# Altium schematic sheet FPGA_PWR.SchDoc
size A4; SheetNumber: 6; SheetTotal: 9
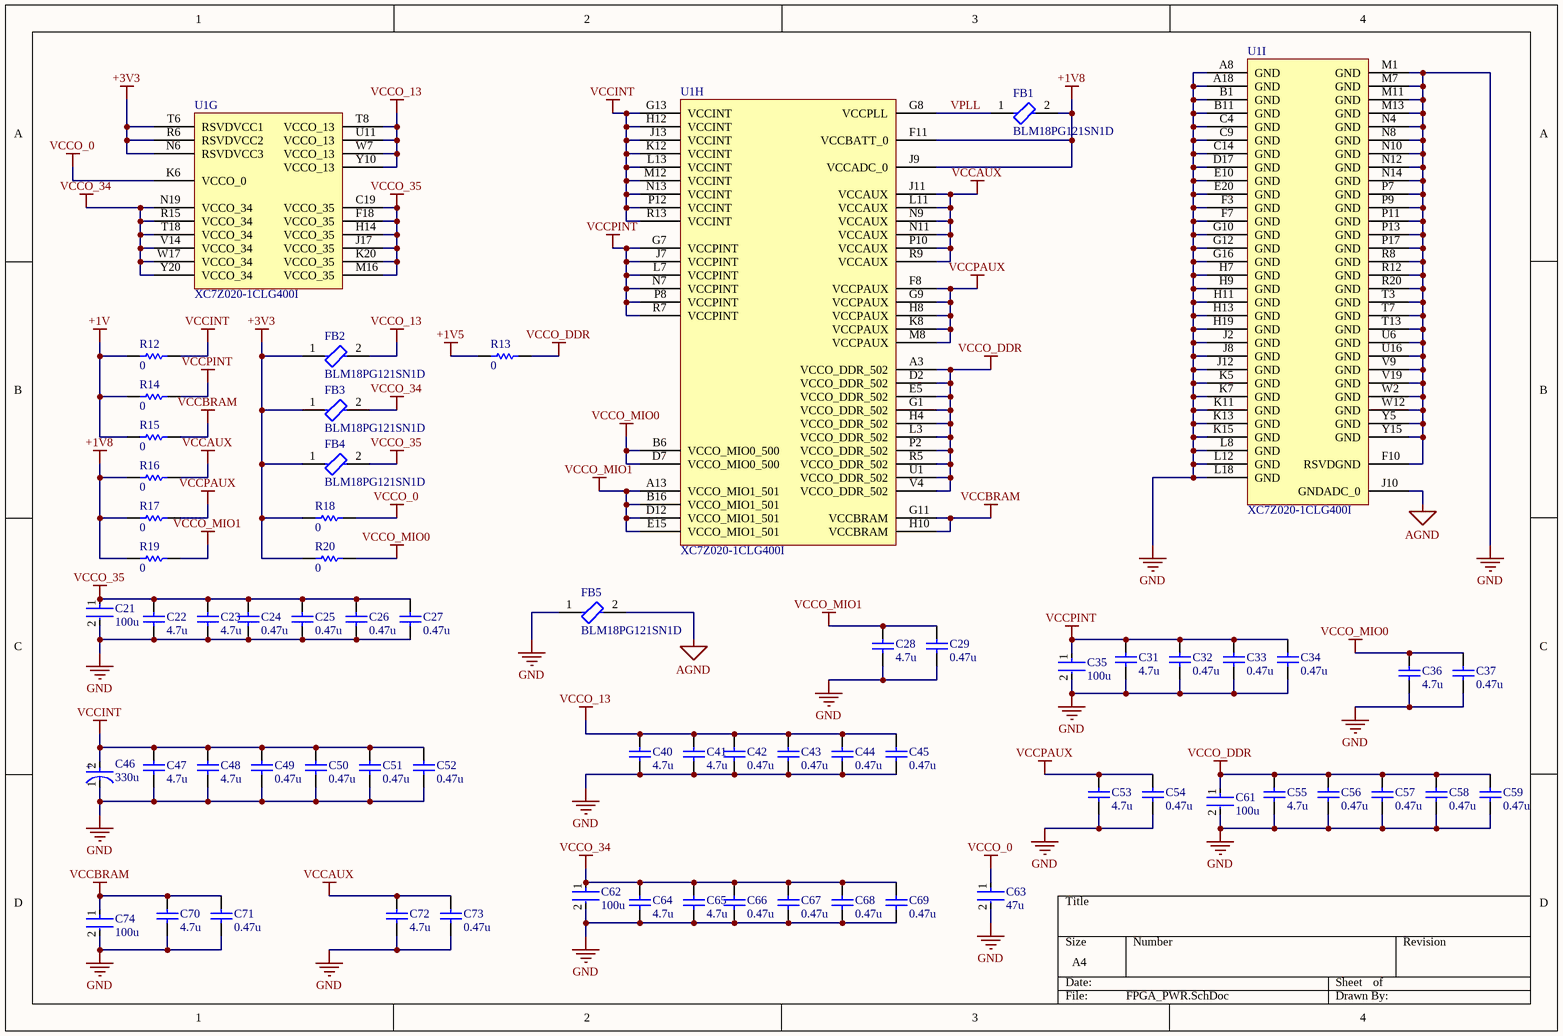
[diagram p0: FPGA_PWR.SchDoc]

## Parts
C21  100u  [FP-GRM32E-0_3-0_2-MFG]
C22  4.7u  [CAPC2013X135X45LL10T25]
C23  4.7u  [CAPC2013X135X45LL10T25]
C24  0.47u  [CAPC1608X90X35LL10T15]
C25  0.47u  [CAPC1608X90X35LL10T15]
C26  0.47u  [CAPC1608X90X35LL10T15]
C27  0.47u  [CAPC1608X90X35LL10T15]
C28  4.7u  [CAPC2013X135X45LL10T25]
C29  0.47u  [CAPC1608X90X35LL10T15]
C31  4.7u  [CAPC2013X135X45LL10T25]
C32  0.47u  [CAPC1608X90X35LL10T15]
C33  0.47u  [CAPC1608X90X35LL10T15]
C34  0.47u  [CAPC1608X90X35LL10T15]
C35  100u  [FP-GRM32E-0_3-0_2-MFG]
C36  4.7u  [CAPC2013X135X45LL10T25]
C37  0.47u  [CAPC1608X90X35LL10T15]
C40  4.7u  [CAPC2013X135X45LL10T25]
C41  4.7u  [CAPC2013X135X45LL10T25]
C42  0.47u  [CAPC1608X90X35LL10T15]
C43  0.47u  [CAPC1608X90X35LL10T15]
C44  0.47u  [CAPC1608X90X35LL10T15]
C45  0.47u  [CAPC1608X90X35LL10T15]
C46  330u  [FP-POSCAP-D2E-MFG]
C47  4.7u  [CAPC2013X135X45LL10T25]
C48  4.7u  [CAPC2013X135X45LL10T25]
C49  0.47u  [CAPC1608X90X35LL10T15]
C50  0.47u  [CAPC1608X90X35LL10T15]
C51  0.47u  [CAPC1608X90X35LL10T15]
C52  0.47u  [CAPC1608X90X35LL10T15]
C53  4.7u  [CAPC2013X135X45LL10T25]
C54  0.47u  [CAPC1608X90X35LL10T15]
C55  4.7u  [CAPC2013X135X45LL10T25]
C56  0.47u  [CAPC1608X90X35LL10T15]
C57  0.47u  [CAPC1608X90X35LL10T15]
C58  0.47u  [CAPC1608X90X35LL10T15]
C59  0.47u  [CAPC1608X90X35LL10T15]
C61  100u  [FP-GRM32E-0_3-0_2-MFG]
C62  100u  [FP-GRM32E-0_3-0_2-MFG]
C63  47u  [FP-GRM32E-0_3-0_2-IPC_C]
C64  4.7u  [CAPC2013X135X45LL10T25]
C65  4.7u  [CAPC2013X135X45LL10T25]
C66  0.47u  [CAPC1608X90X35LL10T15]
C67  0.47u  [CAPC1608X90X35LL10T15]
C68  0.47u  [CAPC1608X90X35LL10T15]
C69  0.47u  [CAPC1608X90X35LL10T15]
C70  4.7u  [CAPC2013X135X45LL10T25]
C71  0.47u  [CAPC1608X90X35LL10T15]
C72  4.7u  [CAPC2013X135X45LL10T25]
C73  0.47u  [CAPC1608X90X35LL10T15]
C74  100u  [FP-GRM32E-0_3-0_2-MFG]
FB1  BLM18PG121SN1D  [FP-BLM18-0_15-t0_8-IPC_A]
FB2  BLM18PG121SN1D  [FP-BLM18-0_15-t0_8-IPC_A]
FB3  BLM18PG121SN1D  [FP-BLM18-0_15-t0_8-IPC_A]
FB4  BLM18PG121SN1D  [FP-BLM18-0_15-t0_8-IPC_A]
FB5  BLM18PG121SN1D  [FP-BLM18-0_15-t0_8-IPC_A]
R12  0  [RESC1608X55X25ML10T15]
R13  0  [RESC1608X55X25ML10T15]
R14  0  [RESC1608X55X25ML10T15]
R15  0  [RESC1608X55X25ML10T15]
R16  0  [RESC1608X55X25ML10T15]
R17  0  [RESC1608X55X25ML10T15]
R18  0  [RESC1608X55X25ML10T15]
R19  0  [RESC1608X55X25ML10T15]
R20  0  [RESC1608X55X25ML10T15]
U1  XC7Z020-1CLG400I  [CLG400]  (parts G,H,I of 9)

## Nets
+1V: R12.2 R14.2 R15.2
+1V5: R13.2
+1V8: FB1.2 R16.2 R17.2 R19.2 U1.F11(VCCBATT_0) U1.J9(VCCADC_0)
+3V3: FB2.1 FB3.1 FB4.1 R18.2 R20.2 U1.N6(RSVDVCC3) U1.R6(RSVDVCC2) U1.T6(RSVDVCC1)
AGND: FB5.2 U1.J10(GNDADC_0)
GND: C21.2 C22.1 C23.1 C24.1 C25.1 C26.1 C27.1 C28.1 C29.1 C31.1 C32.1 C33.1 C34.1 C35.2 C36.1 C37.1 C40.1 C41.1 C42.1 C43.1 C44.1 C45.1 C46.1(C) C47.1 C48.1 C49.1 C50.1 C51.1 C52.1 C53.1 C54.1 C55.1 C56.1 C57.1 C58.1 C59.1 C61.2 C62.2 C63.2 C64.1 C65.1 C66.1 C67.1 C68.1 C69.1 C70.1 C71.1 C72.1 C73.1 C74.2 FB5.1 U1.A8(GND) U1.A18(GND) U1.B1(GND) U1.B11(GND) U1.C4(GND) U1.C9(GND) U1.C14(GND) U1.D17(GND) U1.E10(GND) U1.E20(GND) U1.F3(GND) U1.F7(GND) U1.F10(RSVDGND) U1.G10(GND) U1.G12(GND) U1.G16(GND) U1.H7(GND) U1.H9(GND) U1.H11(GND) U1.H13(GND) U1.H19(GND) U1.J2(GND) U1.J8(GND) U1.J12(GND) U1.K5(GND) U1.K7(GND) U1.K11(GND) U1.K13(GND) U1.K15(GND) U1.L8(GND) U1.L12(GND) U1.L18(GND) U1.M1(GND) U1.M7(GND) U1.M11(GND) U1.M13(GND) U1.N4(GND) U1.N8(GND) U1.N10(GND) U1.N12(GND) U1.N14(GND) U1.P7(GND) U1.P9(GND) U1.P11(GND) U1.P13(GND) U1.P17(GND) U1.R8(GND) U1.R12(GND) U1.R20(GND) U1.T3(GND) U1.T7(GND) U1.T13(GND) U1.U6(GND) U1.U16(GND) U1.V9(GND) U1.V19(GND) U1.W2(GND) U1.W12(GND) U1.Y5(GND) U1.Y15(GND)
VCCAUX: C72.2 C73.2 R16.1 U1.J11(VCCAUX) U1.L11(VCCAUX) U1.N9(VCCAUX) U1.N11(VCCAUX) U1.P10(VCCAUX) U1.R9(VCCAUX)
VCCBRAM: C70.2 C71.2 C74.1 R15.1 U1.G11(VCCBRAM) U1.H10(VCCBRAM)
VCCINT: C46.2(A) C47.2 C48.2 C49.2 C50.2 C51.2 C52.2 R12.1 U1.G13(VCCINT) U1.H12(VCCINT) U1.J13(VCCINT) U1.K12(VCCINT) U1.L13(VCCINT) U1.M12(VCCINT) U1.N13(VCCINT) U1.P12(VCCINT) U1.R13(VCCINT)
VCCO_0: C63.1 R18.1 U1.K6(VCCO_0)
VCCO_13: C40.2 C41.2 C42.2 C43.2 C44.2 C45.2 FB2.2 U1.T8(VCCO_13) U1.U11(VCCO_13) U1.W7(VCCO_13) U1.Y10(VCCO_13)
VCCO_34: C62.1 C64.2 C65.2 C66.2 C67.2 C68.2 C69.2 FB3.2 U1.N19(VCCO_34) U1.R15(VCCO_34) U1.T18(VCCO_34) U1.V14(VCCO_34) U1.W17(VCCO_34) U1.Y20(VCCO_34)
VCCO_35: C21.1 C22.2 C23.2 C24.2 C25.2 C26.2 C27.2 FB4.2 U1.C19(VCCO_35) U1.F18(VCCO_35) U1.H14(VCCO_35) U1.J17(VCCO_35) U1.K20(VCCO_35) U1.M16(VCCO_35)
VCCO_DDR: C55.2 C56.2 C57.2 C58.2 C59.2 C61.1 R13.1 U1.A3(VCCO_DDR_502) U1.D2(VCCO_DDR_502) U1.E5(VCCO_DDR_502) U1.G1(VCCO_DDR_502) U1.H4(VCCO_DDR_502) U1.L3(VCCO_DDR_502) U1.P2(VCCO_DDR_502) U1.R5(VCCO_DDR_502) U1.U1(VCCO_DDR_502) U1.V4(VCCO_DDR_502)
VCCO_MIO0: C36.2 C37.2 R20.1 U1.B6(VCCO_MIO0_500) U1.D7(VCCO_MIO0_500)
VCCO_MIO1: C28.2 C29.2 R19.1 U1.A13(VCCO_MIO1_501) U1.B16(VCCO_MIO1_501) U1.D12(VCCO_MIO1_501) U1.E15(VCCO_MIO1_501)
VCCPAUX: C53.2 C54.2 R17.1 U1.F8(VCCPAUX) U1.G9(VCCPAUX) U1.H8(VCCPAUX) U1.K8(VCCPAUX) U1.M8(VCCPAUX)
VCCPINT: C31.2 C32.2 C33.2 C34.2 C35.1 R14.1 U1.G7(VCCPINT) U1.J7(VCCPINT) U1.L7(VCCPINT) U1.N7(VCCPINT) U1.P8(VCCPINT) U1.R7(VCCPINT)
VPLL: FB1.1 U1.G8(VCCPLL)

## Notes on the sheet
- (in symbol CMP-05428-000851-1) +

## Library data of the parts
C21 C35 C61 C62 C74 = CMP-06035-033326-1: Chip Multilayer Ceramic Capacitors for General Purpose, 1210, 100uF, X7U, +22%/-56%, 20%, 4V; Voltage Rating (DC): 4V; Height: 2.5mm; Lead Free: Lead Free; Max Operating Temperature: 125°C; Capacitance: 100uF; Case Code (Imperial): 1210; Package Quantity: 1; Length: 3.2mm; Number of Pins: 2; Radiation Hardening: No; Case/Package: 1210; Tolerance: 20%; Width: 2.5mm; Packaging: Tape and Reel; Depth: 2.5mm; Min Operating Temperature: -55°C; Dielectric: X7U; Case Code (Metric): 3225; Material: Ceramic; Lead Pitch: 1mm; Mount: Surface Mount; Voltage Rating: 4V; REACH SVHC: No SVHC; Termination: SMD/SMT; Thickness: 0.106inch
C22 C23 C28 C31 C36 C40 C41 C47 C48 C53 C55 C64 C65 C70 C72 = CMP-2007-03555-1: Manufacturer: Murata; Part Number: GRM21BR71A475KA73L
C24-C27 C29 C32-C34 C37 C42-C45 C49-C52 C54 C56-C59 C66-C69 C71 C73 = CMP-2006-02830-1: Part Number: GRM188R70J474KA01D; Manufacturer: Murata
C46 = CMP-05428-000851-1: Molded Tantalum Polymer Capacitor 330uF 20% 6.3V life 2000Hours SMD 2917; ESR (Equivalent Series Resistance): 25mR; Dissipation Factor: 10%; Polarity: Polar; Ripple Current: 2.4A; Leakage Current: 207.9uA; Voltage: 6.3V; Voltage Rating (DC): 6.3V; Tolerance: 20%; Min Operating Temperature: -55°C; Capacitance: 330uF; Termination: SMD/SMT; Height - Seated (Max): 0.079inch; Material: Polymer; Case Code (Metric): 7343; Case Code (Imperial): 2917; Length: 7.3mm; Package Quantity: 3000; Features: General Purpose; Case/Package: 2917; RoHS Compliant: Yes; Voltage Rating: 6.3V; Packaging: Tape and Reel; Width: 4.3mm; Lead Free: Lead Free; Depth: 4.3mm; REACH SVHC: No SVHC; Construction: Flat; Series: POSCAP™ TPE; Height: 1.8mm; Radiation Hardening: No; Max Operating Temperature: 105°C; Mount: Surface Mount
C63 = CMP-06035-057102-1: Chip Multilayer Ceramic Capacitors for General Purpose, 1210, 47uF, X7R, 15%, 20%, 6.3V; Capacitance: 47uF; Radiation Hardening: No; Termination: SMD/SMT; Lead Free: Lead Free; Length: 3.2mm; Depth: 2.5mm; Thickness: 0.106inch; Case Code (Metric): 3225; Width: 0.098inch; Dielectric: X7R; Case/Package: 1210; Mount: Surface Mount; Packaging: Tape and Reel; Package Quantity: 1; Height: 2.5mm; Tolerance: 20%; Max Operating Temperature: 125°C; Voltage Rating (DC): 6.3V; Case Code (Imperial): 1210; Min Operating Temperature: -55°C; Voltage Rating: 6.3V
FB1-FB5 = CMP-0686-00557-7: Chip Ferrite Bead, 0603, 120Ω @ 100MHz, 0.05Ω, 25%, 2A; Impedance: 120R; Number of Circuits: 1; Shielding: Unshielded; Material: Steel; DC Resistance (DCR): 50mR; Case Code (Imperial): 0603; RoHS Compliant: Yes; Number of Pins: 2; Min Operating Temperature: -55°C; Case Code (Metric): 1608; Frequency: 100MHz; Length: 1.6mm; Test Frequency: 100MHz; Max Operating Temperature: 125°C; Packaging: Tape and Reel; Max Current Rating: 2A; Termination: SMD/SMT; Lead Free: Lead Free; Max DC Current: 2A; Case/Package: 0603; Height: 0.8mm; Current Rating: 2A; Radiation Hardening: No; Core Material: Ferrite; DC Current: 2A; REACH SVHC: No SVHC; Package Quantity: 1; Depth: 0.8mm; Number of Lines: 1; Tolerance: 25%; Width: 0.8mm
R12-R20 = CMP-2100-03667-1: Chip Resistor, 0 Ohm, +/- 5%, 0.1 W, -55 to 155 degC, 0603 (1608 Metric), RoHS, Tape and Reel; Manufacturer: Yageo; Temperature Coefficient: 200ppm/degreesC; Voltage Rating: 50V; Power Rating: 100mW; Resistance: 0mOhm; Width: 0.8mm; Max Operating Temperature: 155degC; Tolerance: 5%; Package Reference: 0603; Height: 0.45mm; Depth: 0.8mm; Package Description: 2-Pin Surface Mount Device, Body 1.6 x 0.8 mm; Termination: SMD/SMT; Package Quantity: 5000; Case/Package: 0603; Case Code (Imperial): 0603; Radiation Hardening: No; Number of Pins: 2; Length: 1.6mm; Lead Free: LeadFree; Voltage Rating (DC): 50V; Military Standard: Not; Datasheet URL: http://www.yageo.com/NewPortal/yageodocoutput?fileName=/pdf/R-Chip/PYu-RC_Group_51_RoHS_L_5.pdf; Manufacturer URL: http://www.yageo.com/; Packaging: TapeandReel; Case Code (Metric): 1608; Min Operating Temperature: -55degC; Composition: ThickFilm; RoHSCompliant: true; Contact Plating: Tin; Datasheet Version: Rev. 5, 10/2016; REACH SVHC: NoSVHC
U1 = CMP-0363-00001-3: 667 MHz Zynq™-7000 AP SoC, 130 PS I/O, 125 FPGA I/O, 400-Ball BGA, Speed Grade 1, Industrial Grade, Pb-Free; LUTs: 53200; Flip Flops: 106400; Extensible Block RAM (# 36Kb Blocks): 560 KB (140); Speed Grade: -1; RoHS: Pb-Free; ComponentLink3Description: DC and AC Switching Characteristics; ComponentLink6Description: PCB and Layout Guide; ComponentLink1Description: Datasheet; ComponentLink4URL: http://www.xilinx.com/support/packagefiles/z7packages/xc7z020clg400pkg.txt; ComponentLink2Description: Package Specification; PackageReference: CLG400; ComponentLink4Description: Package File; Generic Part Number: XC7Z020; ComponentLink6URL: http://www.xilinx.com/support/documentation/user_guides/ug483_7Series_PCB.pdf; PackageVersion: Rev 1.1, 09/2012; PartNumber: XC7Z020-1CLG400I; PackageDescription: Wire-Bond Chip-Scale BGA, Body 17 x 17 mm, 0.8 mm Pitch; ComponentLink5Description: Packaging and Pinout; ComponentLink2URL: http://www.xilinx.com/support/documentation/user_guides/ug865-Zynq-7000-Pkg-Pinout.pdf; ComponentLink5URL: http://www.xilinx.com/support/documentation/user_guides/ug865-Zynq-7000-Pkg-Pinout.pdf; DatasheetVersion: v1.2; Code_JEDEC: MO-275-MMAA-1; Mounting Technology: Surface Mount; ComponentLink3URL: http://www.xilinx.com/support/documentation/data_sheets/ds187-XC7Z010-XC7Z020-Data-Sheet.pdf; ComponentLink1URL: http://www.xilinx.com/support/documentation/data_sheets/ds190-Zynq-7000-Overview.pdf